# Altium schematic sheet PCB_Master_Traffic_Light.SchDoc
size A3; SheetNumber: 1; SheetTotal: 3; SPICEModelCacheWQSXSIZM: <root> / <DocumentId>WQSXSIZM</DocumentId> / <CacheFrame Number="0"> / <Model Name="1812_885012010015_22nf" Kind="CKT"> / <Text>******* / .subckt 1812_885012010015_22nF 1 2 / Rser 1 3 0.0255141881395 / Lser 2 4 3.80015608E-10 / C1 3 4 0.000000022 / Rpar 3 4 10000000000 / .ends 1812_885012010015_22nF</Text> / </Model> / </CacheFrame> / </root>
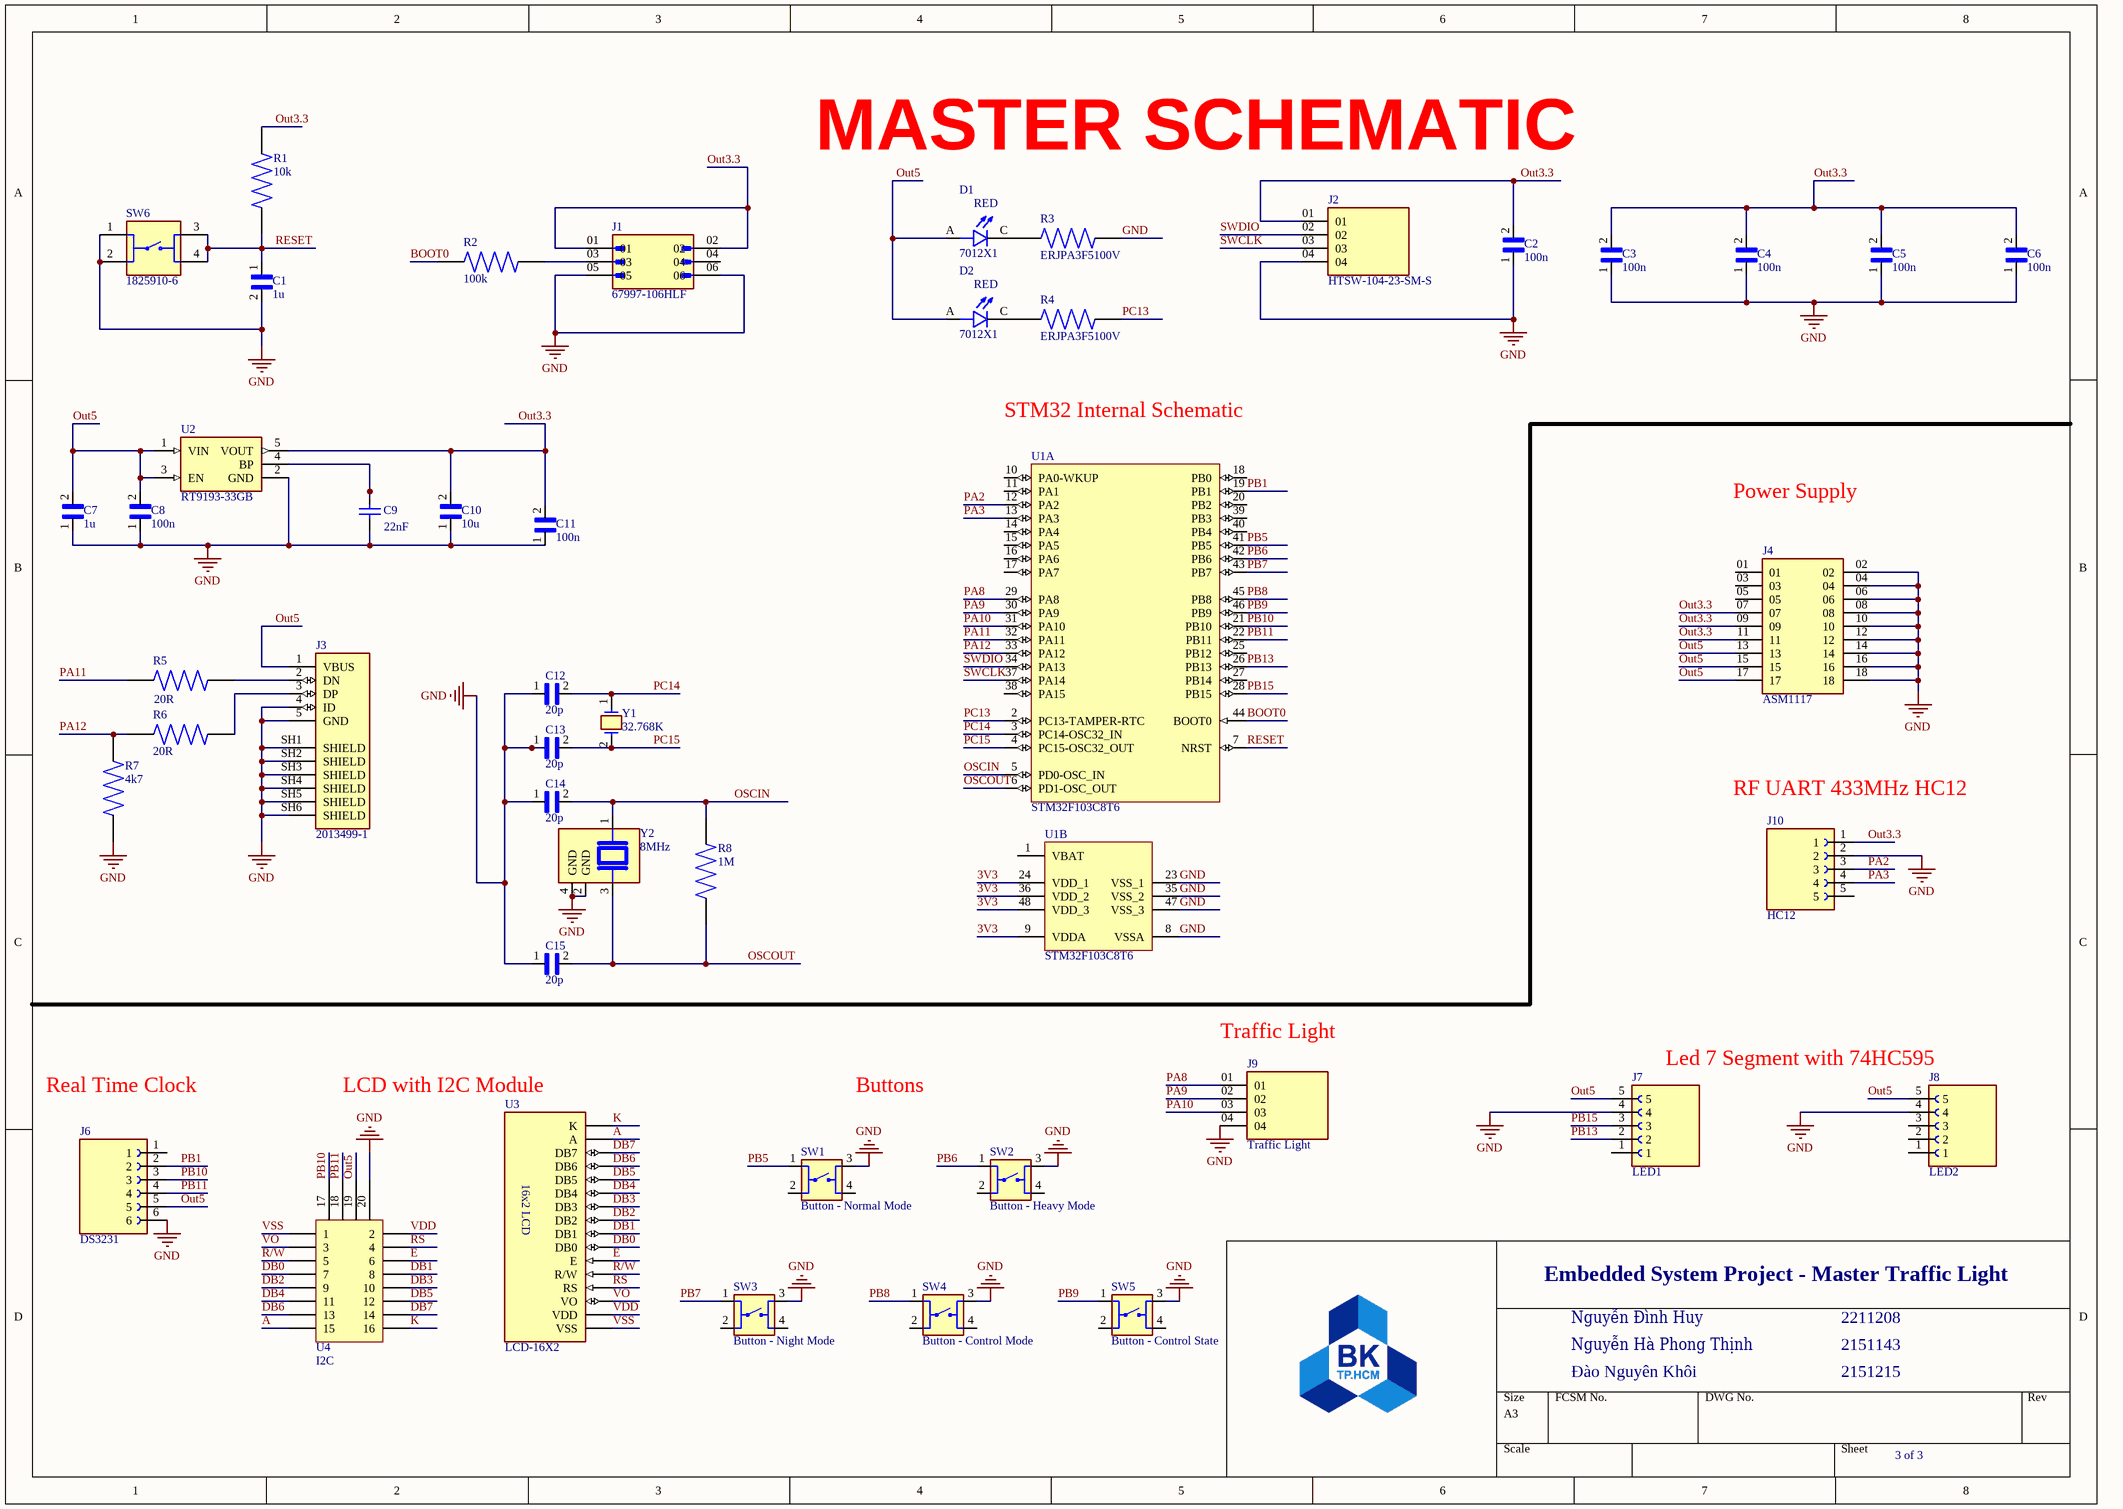
[diagram p0: PCB_Master_Traffic_Light.SchDoc]

## Parts
C1  1u  [CAPC2012X145N]
C2  100n  [CAPC2012X100N]
C3  100n  [CAPC2012X100N]
C4  100n  [CAPC2012X100N]
C5  100n  [CAPC2012X100N]
C6  100n  [CAPC2012X100N]
C7  1u  [CAPC2012X145N]
C8  100n  [CAPC2012X100N]
C9  22nF  [WCAP-CSGP_1812_L4.5W3.2H1.25]
C10  10u  [CAPC2012X100N]
C11  100n  [CAPC2012X100N]
C12  20p  [CAPC2012X100N]
C13  20p  [CAPC2012X100N]
C14  20p  [CAPC2012X100N]
C15  20p  [CAPC2012X100N]
D1  7012X1  [LED_7012X1]
D2  7012X1  [LED_7012X1]
J1  67997-106HLF  [AMPHENOL_67997-106HLF]
J2  HTSW-104-23-SM-S  [SAMTEC_HTSW-104-23-SM-S]
J3  2013499-1  [TE_2013499-1]
J4  ASM1117  [SAMTEC_MTSW-109-13-G-D-905]
J6  DS3231  [HARWIN_M20-7820646]
J7  LED1  [HARWIN_M20-7820546]
J8  LED2  [HARWIN_M20-7820546]
J9  Traffic Light  [SAMTEC_HTSW-104-23-SM-S]
J10  HC12  [HARWIN_M20-7820546]
R1  10k  [RESC2012X60N]
R2  100k  [RESC2012X60N]
R3  ERJPA3F5100V  [RES_ERJPA3F5100V]
R4  ERJPA3F5100V  [RES_ERJPA3F5100V]
R5  20R  [RESC5025X120N]
R6  20R  [RESC5025X120N]
R7  4k7  [RESC1608X55N]
R8  1M  [RESC2012X60N]
SW1  Button - Normal Mode  [SW_FSM8JH]
SW2  Button - Heavy Mode  [SW_FSM8JH]
SW3  Button - Night Mode  [SW_FSM8JH]
SW4  Button - Control Mode  [SW_FSM8JH]
SW5  Button - Control State  [SW_FSM8JH]
SW6  1825910-6  [SW_1825910-6-4]
U1  STM32F103C8T6  [STM-LQFP48_L]  (parts A,B of 2)
U2  RT9193-33GB  [SOT94P279X129-5N]
U3  LCD-16X2  [MODULE_LCD-16X2]
U4  I2C  [PCF8574]
Y1  32.768K  [XTAL_NX3215SA-32.768K-STD-MUA-14]
Y2  8MHz  [XTAL_ABM3B-8.000MHZ-10-1-U-T]

## Nets
GND: C1.2 C2.1 C3.1 C4.1 C5.1 C6.1 C7.1 C8.1 C9.1 C10.1 C11.1 C12.1 C13.1 C14.1 C15.1 J1.05 J1.06 J2.04 J3.4(ID) J3.5(GND) J3.SH1(SHIELD) J3.SH2(SHIELD) J3.SH3(SHIELD) J3.SH4(SHIELD) J3.SH5(SHIELD) J3.SH6(SHIELD) J4.02 J4.04 J4.06 J4.08 J4.10 J4.12 J4.14 J4.16 J4.18 J6.6 J7.4 J8.4 J9.04 J10.2 R3.2 R7.1 SW1.3 SW2.3 SW3.3 SW4.3 SW5.3 SW6.1 SW6.2 U1.8(VSSA) U1.23(VSS_1) U1.35(VSS_2) U1.47(VSS_3) U2.2(GND) U4.20 Y2.2(GND) Y2.4(GND)
3V3: U1.9(VDDA) U1.24(VDD_1) U1.36(VDD_2) U1.48(VDD_3)
A: U3.15(A) U4.15
BOOT0: R2.1 U1.44(BOOT0)
DB0: U3.7(DB0) U4.7
DB1: U3.8(DB1) U4.8
DB2: U3.9(DB2) U4.9
DB3: U3.10(DB3) U4.10
DB4: U3.11(DB4) U4.11
DB5: U3.12(DB5) U4.12
DB6: U3.13(DB6) U4.13
DB7: U3.14(DB7) U4.14
E: U3.6(E) U4.6
K: U3.16(K) U4.16
OSCIN: C14.2 R8.2 U1.5(PD0-OSC_IN) Y2.1
OSCOUT: C15.2 R8.1 U1.6(PD1-OSC_OUT) Y2.3
Out3.3: C2.2 C3.2 C4.2 C5.2 C6.2 C10.2 C11.2 J1.01 J1.02 J2.01 J4.07 J4.09 J4.11 J10.1 R1.1 U2.5(VOUT)
Out5: C7.2 C8.2 D1.A D2.A J3.1(VBUS) J4.13 J4.15 J4.17 J6.5 J7.5 J8.5 U2.1(VIN) U2.3(EN) U4.19
PA2: J10.3 U1.12(PA2)
PA3: J10.4 U1.13(PA3)
PA8: J9.01 U1.29(PA8)
PA9: J9.02 U1.30(PA9)
PA10: J9.03 U1.31(PA10)
PA11: R5.1 U1.32(PA11)
PA12: R6.1 R7.2 U1.33(PA12)
PB1: J6.2 U1.19(PB1)
PB5: SW1.1 U1.41(PB5)
PB6: SW2.1 U1.42(PB6)
PB7: SW3.1 U1.43(PB7)
PB8: SW4.1 U1.45(PB8)
PB9: SW5.1 U1.46(PB9)
PB10: J6.3 U1.21(PB10) U4.17
PB11: J6.4 U1.22(PB11) U4.18
PB13: J7.2 U1.26(PB13)
PB15: J7.3 U1.28(PB15)
PC13: R4.2 U1.2(PC13-TAMPER-RTC)
PC14: C12.2 U1.3(PC14-OSC32_IN) Y1.1
PC15: C13.2 U1.4(PC15-OSC32_OUT) Y1.2
R/W: U3.5(R/W) U4.5
RESET: C1.1 R1.2 SW6.3 SW6.4 U1.7(NRST)
RS: U3.4(RS) U4.4
SWCLK: J2.03 U1.37(PA14)
SWDIO: J2.02 U1.34(PA13)
VDD: U3.2(VDD) U4.2
VO: U3.3(VO) U4.3
VSS: U3.1(VSS) U4.1
NetC9_2: C9.2 U2.4(BP)
NetD1_C: D1.C R3.1
NetD2_C: D2.C R4.1
NetJ1_03: J1.03 R2.2
NetJ3_2: J3.2(DN) R5.2
NetJ3_3: J3.3(DP) R6.2

Not connected (* = marked no-connect by the designer): J1 04; J4 01 03 05; J6 1; J7 1; J8 1 2 3; J10 5; SW1 2 4; SW2 2 4; SW3 2 4; SW4 2 4; SW5 2 4; U1 1(VBAT) 10(PA0-WKUP) 11(PA1) 14(PA4) 15(PA5) 16(PA6) 17(PA7) 18(PB0) 20(PB2) 25(PB12) 27(PB14) 38(PA15) 39(PB3) 40(PB4)

## Notes on the sheet
- MASTER SCHEMATIC
- STM32 Internal Schematic
- Power Supply
- (near J10) RF UART 433MHz HC12
- (near J9) Traffic Light
- Real Time Clock
- (near U3) LCD with I2C Module
- Buttons
- Led 7 Segment with 74HC595
- Embedded System Project - Master Traffic Light
- Nguyễn Đình Huy
- 2211208
- Nguyễn Hà Phong Thịnh
- Đào Nguyên Khôi
- 2151143
- 2151215
- 3 of 3
- (in symbol 7012X1) RED
- (in symbol LCD-16X2) 16x2 LCD

## Library data of the parts
C1 C7 = C2012X5R1E105K125AA: 1 ÂµF Â±10% 25V Ceramic Capacitor X5R 0805 (2012 Metric); MF: TDK; Check_prices: https://www.snapeda.com/parts/C2012X5R1E105K125AA/TDK/view-part/?ref=eda; Value: *; SnapEDA_Link: https://www.snapeda.com/parts/C2012X5R1E105K125AA/TDK/view-part/?ref=snap; Package: 2012 TDK; Digi-Key_Part_Number: 445-1419-2-ND; MP: C2012X5R1E105K125AA
C2-C6 C8 C11 = C2012X7R1H104K085AA: 0.1 ÂµF Â±10% 50V Ceramic Capacitor X7R 0805 (2012 Metric); MF: TDK; Purchase-URL: https://pricing.snapeda.com/search/part/C2012X7R1H104K085AA/?ref=eda; Package: 2012 TDK; MP: C2012X7R1H104K085AA; Value: *; SnapEDA_Link: https://www.snapeda.com/parts/C2012X7R1H104K085AA/TDK/view-part/?ref=snap; Digi-Key_Part_Number: 445-7534-1-ND; Check_prices: https://www.snapeda.com/parts/C2012X7R1H104K085AA/TDK/view-part/?ref=eda
C9 = 885012010015: WCAP-CSGP Multilayer Ceramic Chip Capacitor, General Purpose, size 1812, NP0, 22nF, 50V; Manufacturer: Wurth Elektronik; Case/Size Code: 1812; Capacitance Tolerance: +/-5%; Insulation Resistance: 10GΩ; Q Factor: 1000; Technical Reference: NP01812223J050DFCT10000; Manufacturer Part Number: 885012010015; Category: Multilayer Ceramic Chip Capacitors; Match Code: WCAP-CSGP; ComponentLink1Description: Website Link; ComponentLink1URL: https://www.we-online.com/redexpert/article/885012010015?ad; ComponentLink2Description: Datasheet Link; ComponentLink2URL: https://www.we-online.com/redexpert/spec/885012010015?ad; Mount: Surface Mount; Min Operating Temperature: -55°C; Max Operating Temperature: 125°C; Packaging: Tape and Reel; Length: 4.5mm; Width: 3.2mm; Height: 1.25mm; Capacitance: 22nF; Ceramic Type: NP0; Rated Voltage (DC): 50V
C10 = C2012X5R1C106M085AC: 10ÂµF Â±20% 16V Ceramic Capacitor X5R 0805 (2012 Metric); MF: TDK; Value: *; SnapEDA_Link: https://www.snapeda.com/parts/C2012X5R1C106M085AC/TDK/view-part/?ref=snap; Purchase-URL: https://pricing.snapeda.com/search/part/C2012X5R1C106M085AC/?ref=eda; Price: None; Availability: In Stock; Package: 2012 TDK; MP: C2012X5R1C106M085AC; Check_prices: https://www.snapeda.com/parts/C2012X5R1C106M085AC/TDK/view-part/?ref=eda
C12-C15 = GQM2195C2E200JB12D: SMD Capacitor C0G(EIA) with Capacitance: 20pF Tol. 5%. Rated Voltage: 250Vdc; MF: Murata; Price: None; Value: *; Availability: Warning; SnapEDA_Link: https://www.snapeda.com/parts/GQM2195C2E200JB12D/Murata/view-part/4378826/?ref=snap; MP: GQM2195C2E200JB12D; Package: 2012 Murata; Purchase-URL: https://pricing.snapeda.com/search/part/GQM2195C2E200JB12D/?ref=eda
D1 D2 = 7012X1: Red - LED Indication - Discrete 1.7V 0805 (2012 Metric); MF: VCC; Package: 0805 Visual Communications; Purchase-URL: https://pricing.snapeda.com/search/part/7012X1/?ref=eda; MP: 7012X1; Value: *; Availability: In Stock; SnapEDA_Link: https://www.snapeda.com/parts/7012X1/Visual+Communications/view-part/?ref=snap; Price: None; Check_prices: https://www.snapeda.com/parts/7012X1/Visual+Communications/view-part/?ref=eda
J1 = 67997-106HLF: BergStikÂ®, Board to Board connector, Unshrouded vertical header, Through Hole, Double Row, 6 Positions, 2.54 mm (0.100in) Pitch; MF: Amphenol ICC; Availability: In Stock; Purchase-URL: https://pricing.snapeda.com/search/part/67997-106HLF/?ref=eda; Package: None; SnapEDA_Link: https://www.snapeda.com/parts/67997-106HLF/Amphenol+FCI/view-part/?ref=snap; MP: 67997-106HLF; Check_prices: https://www.snapeda.com/parts/67997-106HLF/Amphenol+FCI/view-part/?ref=eda; Price: None; Value: *
J2 J9 = HTSW-104-23-SM-S: HEADER, 4 CONTACTS, 1 ROW, THROUGH HOLE, 2.54 MM; Connector Systems:Board-to-Board; Pitch Spacing:2.54mm; No. of Rows:1Rows; No. of Contacts:4Contacts; Contact Termination Type:Through Hole; Product Range:HTSW Series; Gender:Header RoHS Compliant: Yes; MF: Samtec; MP: HTSW10423SMS; Package: None; Price: None; Check_prices: https://www.snapeda.com/parts/HTSW10423SMS/Samtec/view-part/?ref=eda; Value: *; SnapEDA_Link: https://www.snapeda.com/parts/HTSW10423SMS/Samtec/view-part/?ref=snap; Availability: In Stock; Purchase-URL: https://pricing.snapeda.com/search/part/HTSW10423SMS/?ref=eda
J4 = MTSW-109-13-G-D-905: Package: None; Price: None; Value: *; MP: MTSW-109-13-G-D-905; Availability: Unavailable
J6 = M20-7820646: Package: None; Price: None; Value: *; MP: M20-7820646; Availability: Unavailable
J7 J8 J10 = M20-7820546: Package: None; Price: None; Value: *; MP: M20-7820546; Availability: Unavailable
R1 = RC0805FR-0710KL: 10 kOhms Â±1% 0.125W, 1/8W Chip Resistor 0805 (2012 Metric) Moisture Resistant Thick Film; MF: Yageo; Value: *; SnapEDA_Link: https://www.snapeda.com/parts/RC0805FR-0710KL/Yageo/view-part/?ref=snap; Purchase-URL: https://pricing.snapeda.com/search/part/RC0805FR-0710KL/?ref=eda; Availability: In Stock; Price: None; Package: 2012 Rohm Semiconductor; Check_prices: https://www.snapeda.com/parts/RC0805FR-0710KL/Yageo/view-part/?ref=eda; MP: RC0805FR-0710KL
R2 = RC0805FR-07100KL: 100 kOhms Â±1% 0.125W, 1/8W Chip Resistor 0805 (2012 Metric) Moisture Resistant Thick Film; MF: Yageo; SnapEDA_Link: https://www.snapeda.com/parts/RC0805FR-07100KL/Yageo/view-part/?ref=snap; Package: 2012 Yageo; Value: *; MP: RC0805FR-07100KL; Check_prices: https://www.snapeda.com/parts/RC0805FR-07100KL/Yageo/view-part/?ref=eda
R3 R4 = ERJPA3F5100V: RES, THICK FILM, 510R, 1%, 0.25W, 0603; MF: Panasonic; MP: ERJ-PA3F5100V; SnapEDA_Link: https://www.snapeda.com/parts/ERJ-PA3F5100V/Panasonic/view-part/?ref=snap; Package: 1608-2 Panasonic; Value: *; Check_prices: https://www.snapeda.com/parts/ERJ-PA3F5100V/Panasonic/view-part/?ref=eda
R5 R6 = 3-2176397-2: Package: None; Price: None; Value: *; MP: 3-2176397-2; Availability: Unavailable
R7 = CRG0603F4K7: Resistor, Thick Film, Res 4.7 Kilohms, Pwr-Rtg 0.1 W, Tol 1%, SMT, 0603 | TE Connectivity CRG0603F4K7; Power_Rating: .1 W; Resistance: 4.7K; Voltage_Rating: 50 V; SnapEDA_Link: https://www.snapeda.com/parts/CRG0603F4K7/TE+Connectivity+Passive+Product/view-part/?ref=snap; Package: 0603; Value: *; MF: TE Connectivity; MP: CRG0603F4K7; EU_RoHS_Compliance: Compliant with Exemptions; Tolerance: 1%; Check_prices: https://www.snapeda.com/parts/CRG0603F4K7/TE+Connectivity+Passive+Product/view-part/?ref=eda
R8 = RC0805FR-071ML: 1 MOhms Â±1% 0.125W, 1/8W Chip Resistor 0805 (2012 Metric) Moisture Resistant Thick Film; MF: Yageo; SnapEDA_Link: https://www.snapeda.com/parts/RC0805FR-071ML/Yageo/view-part/?ref=snap; Package: 2012 Yageo; Value: *; MP: RC0805FR-071ML; Check_prices: https://www.snapeda.com/parts/RC0805FR-071ML/Yageo/view-part/?ref=eda
SW1-SW5 = FSM8JH: Tactile Switch SPST-NO Top Actuated Through Hole; MF: TE Connectivity; Check_prices: https://www.snapeda.com/parts/FSM8JH/TE+Connectivity+ALCOSWITCH+Switches/view-part/?ref=eda; Value: *; Availability: In Stock; MP: FSM8JH; Price: None; Package: None; SnapEDA_Link: https://www.snapeda.com/parts/FSM8JH/TE+Connectivity+ALCOSWITCH+Switches/view-part/?ref=snap
SW6 = 1825910-6: Switch Push Button OFF (ON) SPST Round Button 0.05A 24VDC Momentary Contact PC Pins Thru-Hole; MF: TE Connectivity; Value: *; MP: 1825910-6; Package: None; Check_prices: https://www.snapeda.com/parts/1825910-6/TE+Connectivity+ALCOSWITCH+Switches/view-part/?ref=eda; SnapEDA_Link: https://www.snapeda.com/parts/1825910-6/TE+Connectivity+ALCOSWITCH+Switches/view-part/?ref=snap; Digi-Key_Part_Number: 450-1650-ND; Purchase-URL: https://pricing.snapeda.com/search/part/1825910-6/?ref=eda
U1 = CMP-0237-00215-3: ARM Cortex-M3 32-bit MCU, 64 KB Flash, 20 KB Internal RAM, 37 I/Os, 48-pin LQFP, -40 to 85 degC, Tray; Supply Voltage(Vcc) min (V): 2; Internal RAM Size (kB): 20; FLASH Size (Prog) (kB): 64; A/D Converter: 2x12-bit (10 Channel); I/Os (High Current): 37; Operating Frequency(F) (Processor speed) (MHz): 72; Core: ARM Cortex-M3; ComponentLink3Description: Package Specification; Mounting Technology: Surface Mount; PartNumber: STM32F103C8T6; PackageReference: LQFP48; Packing: Tray; ComponentLink3URL: http://www.st.com/st-web-ui/static/active/en/resource/technical/document/datasheet/DM00058181.pdf; DatasheetVersion: Rev. 16; ComponentLink1URL: http://www.st.com/web/en/home.html; PackageVersion: Rev. 6, 06/2013; ComponentLink2URL: http://www.st.com/st-web-ui/static/active/en/resource/technical/document/datasheet/CD00161566.pdf; ComponentLink1Description: Manufacturer URL; ComponentLink2Description: Datasheet; PackageDescription: 48-Pin Low Profile Quad Flat Package, 7 x 7 mm Body, 0.5 mm Pitch
U2 = RT9193-33GB: Linear Voltage Regulator IC Positive Fixed 1 Output 300mA TSOT-23-5; MF: Richtek USA; SnapEDA_Link: https://www.snapeda.com/parts/RT9193-33GB/Richtek+USA+Inc./view-part/?ref=snap; Package: SOT-23-5 Richtek; MP: RT9193-33GB; Check_prices: https://www.snapeda.com/parts/RT9193-33GB/Richtek+USA+Inc./view-part/?ref=eda; Purchase-URL: https://pricing.snapeda.com/search/part/RT9193-33GB/?ref=eda; Digi-Key_Part_Number: 1028-1014-2-ND; Value: *
U3 = LCD-16X2: Display Development Tools 16x2 Black on Green Char LCD w Backlight; MF: Gravitech; SnapEDA_Link: https://www.snapeda.com/parts/LCD-16X2/Gravitech/view-part/?ref=snap; Package: None; Value: *; MP: LCD-16X2; Check_prices: https://www.snapeda.com/parts/LCD-16X2/Gravitech/view-part/?ref=eda
U4 = PCF8574
Y1 = NX3215SA-32.768K-STD-MUA-14: 32.768kHz Â±20ppm Crystal 6pF 70 kOhms 2-SMD, No Lead  MANUFACTURER: NIHON DEMPA KOGYO; Availability: Unavailable; Package: None; MP: NX3215SA-32.768K-STD-MUA-14; Value: *; Price: None
Y2 = ABM3B-8.000MHZ-10-1-U-T: 8 MHz Â±10ppm Crystal 10pF 200 Ohms 4-SMD, No Lead; MF: Abracon; SnapEDA_Link: https://www.snapeda.com/parts/ABM3B-8.000MHZ-10-1-U-T/Abracon/view-part/?ref=snap; Package: SMD-4 Abracon LLC; Value: *; MP: ABM3B-8.000MHZ-10-1-U-T; Check_prices: https://www.snapeda.com/parts/ABM3B-8.000MHZ-10-1-U-T/Abracon/view-part/?ref=eda
J3 = 2013499-1: Package: None; Price: None; Value: *; MP: 2013499-1; Availability: Unavailable